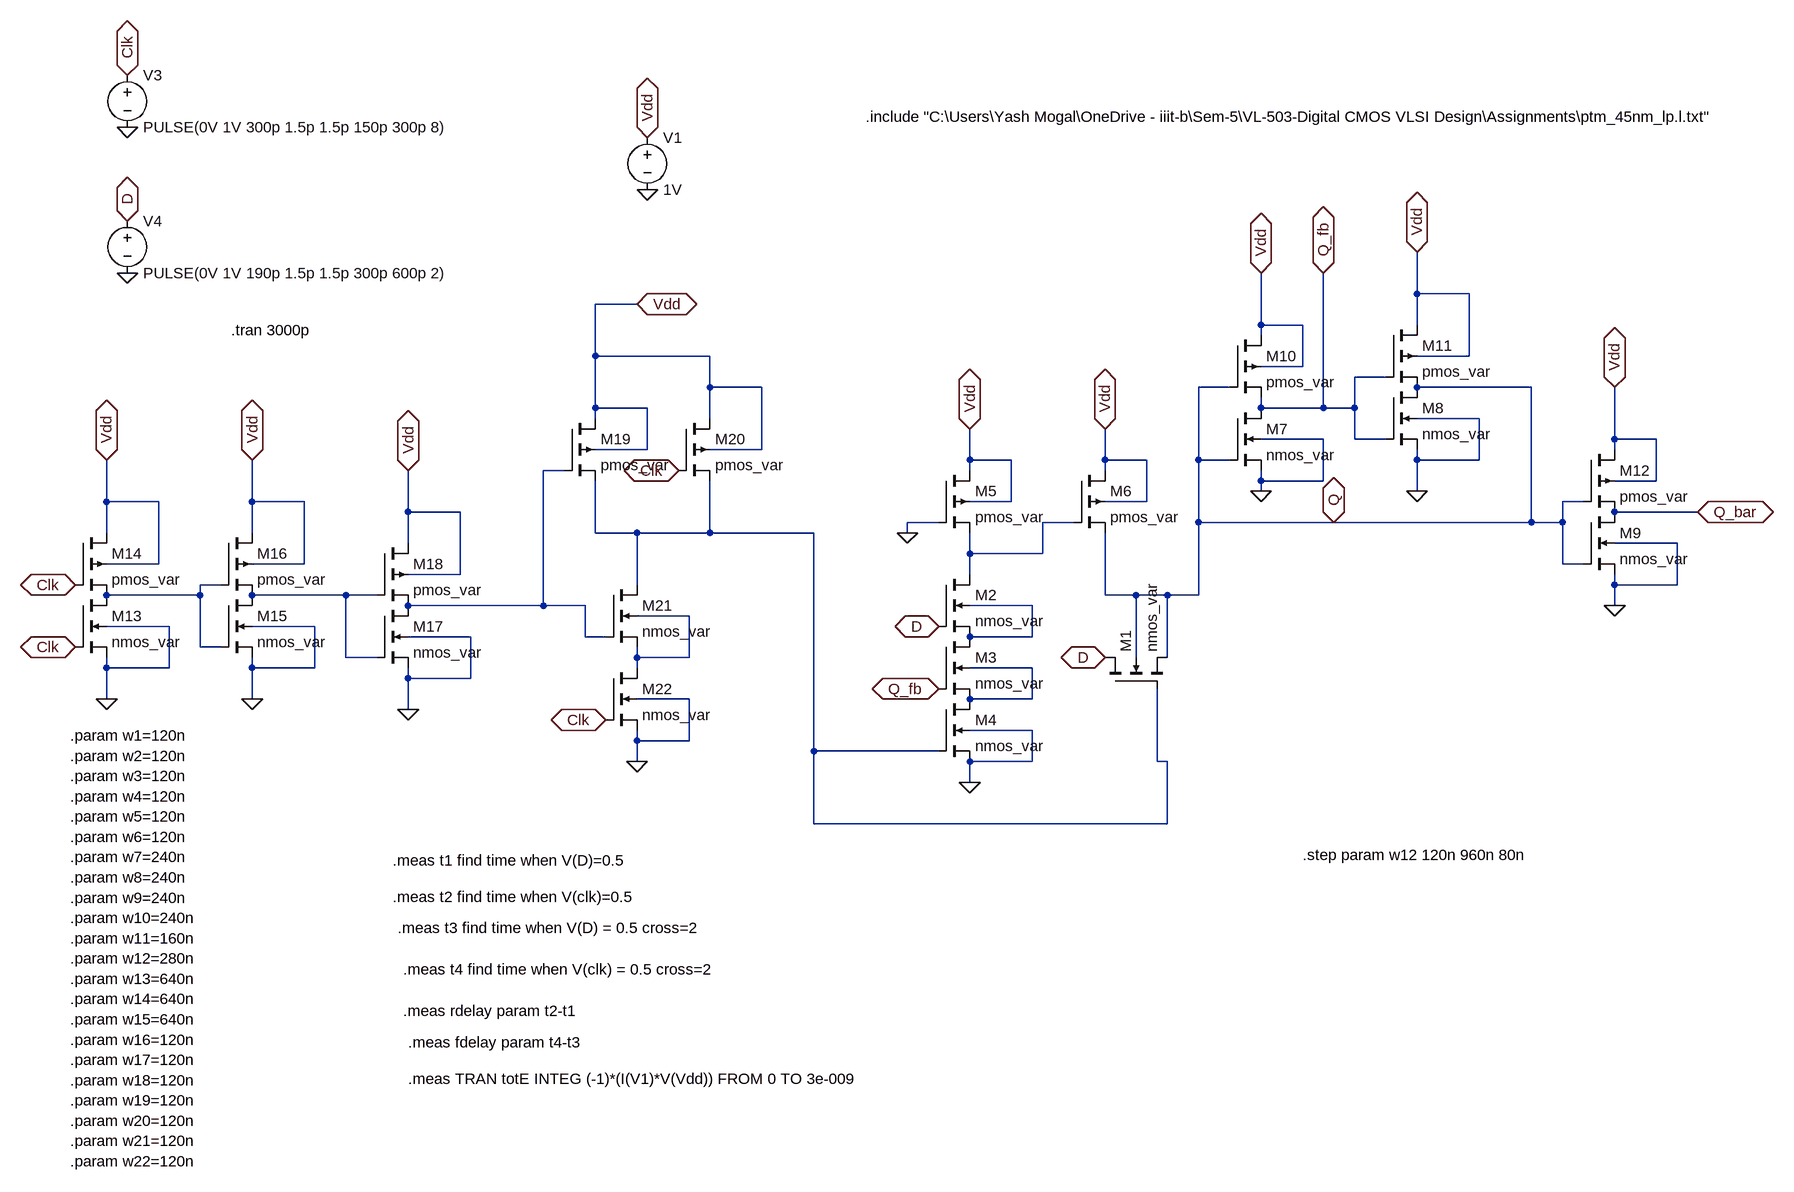
[diagram p0: schematic Project_SFTPFF.asc]
Project_SFTPFF.asc, the LTspice schematic file:
Version 4
SHEET 1 1344 836
WIRE 736 -448 736 -512
WIRE 816 -448 736 -448
WIRE -464 -432 -528 -432
WIRE 496 -400 496 -480
WIRE 560 -400 496 -400
WIRE 736 -400 736 -448
WIRE 496 -384 496 -400
WIRE -528 -352 -528 -432
WIRE -352 -352 -528 -352
WIRE 816 -352 816 -448
WIRE 816 -352 736 -352
WIRE 560 -336 560 -400
WIRE 560 -336 496 -336
WIRE 688 -320 640 -320
WIRE -352 -304 -352 -352
WIRE -272 -304 -352 -304
WIRE 448 -304 400 -304
WIRE 912 -304 736 -304
WIRE -528 -272 -528 -352
WIRE -448 -272 -528 -272
WIRE 496 -272 496 -288
WIRE 592 -272 592 -480
WIRE 592 -272 496 -272
WIRE 640 -272 640 -320
WIRE 640 -272 592 -272
WIRE -528 -256 -528 -272
WIRE -352 -256 -352 -304
WIRE 832 -256 736 -256
WIRE 592 -224 496 -224
WIRE 640 -224 640 -272
WIRE 688 -224 640 -224
WIRE 1040 -224 1040 -304
WIRE 1104 -224 1040 -224
WIRE -448 -208 -448 -272
WIRE -448 -208 -528 -208
WIRE -272 -208 -272 -304
WIRE -272 -208 -352 -208
WIRE 1040 -208 1040 -224
WIRE 48 -192 48 -240
WIRE 112 -192 48 -192
WIRE 256 -192 256 -240
WIRE 320 -192 256 -192
WIRE 400 -192 400 -304
WIRE 448 -192 400 -192
WIRE 736 -192 736 -208
WIRE 832 -192 832 -256
WIRE 832 -192 736 -192
WIRE -576 -176 -608 -176
WIRE 48 -176 48 -192
WIRE 256 -176 256 -192
WIRE 496 -160 496 -176
WIRE 592 -160 592 -224
WIRE 592 -160 496 -160
WIRE 1104 -160 1104 -224
WIRE 1104 -160 1040 -160
WIRE 496 -144 496 -160
WIRE 736 -144 736 -192
WIRE -1280 -128 -1280 -192
WIRE -1200 -128 -1280 -128
WIRE -1056 -128 -1056 -192
WIRE -976 -128 -1056 -128
WIRE 112 -128 112 -192
WIRE 112 -128 48 -128
WIRE 320 -128 320 -192
WIRE 320 -128 256 -128
WIRE 992 -128 960 -128
WIRE -816 -112 -816 -176
WIRE -736 -112 -816 -112
WIRE 1168 -112 1040 -112
WIRE 0 -96 -48 -96
WIRE 208 -96 160 -96
WIRE 400 -96 400 -192
WIRE 608 -96 400 -96
WIRE 912 -96 912 -304
WIRE 912 -96 608 -96
WIRE 960 -96 960 -128
WIRE 960 -96 912 -96
WIRE -1280 -80 -1280 -128
WIRE -1056 -80 -1056 -128
WIRE -528 -80 -528 -160
WIRE -464 -80 -528 -80
WIRE -352 -80 -352 -160
WIRE -352 -80 -464 -80
WIRE -192 -80 -352 -80
WIRE -48 -80 -48 -96
WIRE -816 -64 -816 -112
WIRE 1136 -64 1040 -64
WIRE 48 -48 48 -80
WIRE 160 -48 160 -96
WIRE 160 -48 48 -48
WIRE -1200 -32 -1200 -128
WIRE -1200 -32 -1280 -32
WIRE -976 -32 -976 -128
WIRE -976 -32 -1056 -32
WIRE 960 -32 960 -96
WIRE 992 -32 960 -32
WIRE -736 -16 -736 -112
WIRE -736 -16 -816 -16
WIRE 48 -16 48 -48
WIRE -1104 0 -1136 0
WIRE -464 0 -464 -80
WIRE 1040 0 1040 -16
WIRE 1136 0 1136 -64
WIRE 1136 0 1040 0
WIRE -1136 16 -1136 0
WIRE -1136 16 -1280 16
WIRE -912 16 -1056 16
WIRE -864 16 -912 16
WIRE 256 16 256 -80
WIRE 304 16 256 16
WIRE 352 16 304 16
WIRE 400 16 400 -96
WIRE 400 16 352 16
WIRE -608 32 -608 -176
WIRE -608 32 -816 32
WIRE -544 32 -608 32
WIRE 144 32 48 32
WIRE 1040 32 1040 0
WIRE -384 48 -464 48
WIRE -1184 64 -1280 64
WIRE -960 64 -1056 64
WIRE -720 80 -816 80
WIRE -544 80 -544 32
WIRE -512 80 -544 80
WIRE 144 80 144 32
WIRE 144 80 48 80
WIRE -1136 96 -1136 16
WIRE -1104 96 -1136 96
WIRE -912 112 -912 16
WIRE -864 112 -912 112
WIRE -464 112 -464 96
WIRE -384 112 -384 48
WIRE -384 112 -464 112
WIRE 304 112 304 16
WIRE 352 112 352 16
WIRE -1280 128 -1280 112
WIRE -1184 128 -1184 64
WIRE -1184 128 -1280 128
WIRE -1056 128 -1056 112
WIRE -960 128 -960 64
WIRE -960 128 -1056 128
WIRE -464 128 -464 112
WIRE 144 128 48 128
WIRE -816 144 -816 128
WIRE -720 144 -720 80
WIRE -720 144 -816 144
WIRE -1280 176 -1280 128
WIRE -1056 176 -1056 128
WIRE -384 176 -464 176
WIRE 144 176 144 128
WIRE 144 176 48 176
WIRE -816 192 -816 144
WIRE 144 224 48 224
WIRE -464 240 -464 224
WIRE -384 240 -384 176
WIRE -384 240 -464 240
WIRE -192 256 -192 -80
WIRE 0 256 -192 256
WIRE -464 272 -464 240
WIRE 144 272 144 224
WIRE 144 272 48 272
WIRE 336 272 336 160
WIRE 352 272 336 272
WIRE 48 304 48 272
WIRE -192 368 -192 256
WIRE 352 368 352 272
WIRE 352 368 -192 368
FLAG 48 304 0
FLAG -1248 -784 Clk
IOPIN -1248 -784 BiDir
FLAG 256 112 D
IOPIN 256 112 BiDir
FLAG 0 64 D
IOPIN 0 64 BiDir
FLAG -448 -688 Vdd
IOPIN -448 -688 BiDir
FLAG 48 -240 Vdd
IOPIN 48 -240 BiDir
FLAG 256 -240 Vdd
IOPIN 256 -240 BiDir
FLAG -448 -608 0
FLAG -48 -80 0
FLAG 496 -144 0
FLAG 496 -480 Vdd
IOPIN 496 -480 BiDir
FLAG 736 -512 Vdd
IOPIN 736 -512 BiDir
FLAG 1040 -304 Vdd
IOPIN 1040 -304 BiDir
FLAG 736 -144 0
FLAG 1040 32 0
FLAG 592 -480 Q_fb
IOPIN 592 -480 BiDir
FLAG 0 160 Q_fb
IOPIN 0 160 BiDir
FLAG 1168 -112 Q_bar
IOPIN 1168 -112 BiDir
FLAG 608 -96 Q
IOPIN 608 -96 BiDir
FLAG -1280 -192 Vdd
IOPIN -1280 -192 BiDir
FLAG -1280 176 0
FLAG -1056 -192 Vdd
IOPIN -1056 -192 BiDir
FLAG -1056 176 0
FLAG -816 -176 Vdd
IOPIN -816 -176 BiDir
FLAG -816 192 0
FLAG -400 -176 Clk
IOPIN -400 -176 BiDir
FLAG -512 208 Clk
IOPIN -512 208 BiDir
FLAG -464 -432 Vdd
IOPIN -464 -432 BiDir
FLAG -464 272 0
FLAG -1328 0 Clk
IOPIN -1328 0 BiDir
FLAG -1328 96 Clk
IOPIN -1328 96 BiDir
FLAG -1248 -704 0
FLAG -1248 -560 D
IOPIN -1248 -560 BiDir
FLAG -1248 -480 0
SYMBOL nmos4 0 -16 R0
SYMATTR InstName M2
SYMATTR Value nmos_var
SYMATTR Value2 l=45nm w=w13
SYMBOL nmos4 0 80 R0
SYMATTR InstName M3
SYMATTR Value nmos_var
SYMATTR Value2 l=45nm w=w14
SYMBOL nmos4 0 176 R0
SYMATTR InstName M4
SYMATTR Value nmos_var
SYMATTR Value2 l=45nm w=w15
SYMBOL nmos4 256 160 R270
SYMATTR InstName M1
SYMATTR Value nmos_var
SYMATTR Value2 l=45nm w=w16
SYMBOL pmos4 0 -176 R0
SYMATTR InstName M5
SYMATTR Value pmos_var
SYMATTR Value2 l=45nm w=w11
SYMBOL pmos4 208 -176 R0
SYMATTR InstName M6
SYMATTR Value pmos_var
SYMATTR Value2 l=45nm w=w12
SYMBOL voltage -448 -704 R0
WINDOW 123 0 0 Left 0
WINDOW 39 0 0 Left 0
SYMATTR InstName V1
SYMATTR Value 1V
SYMBOL nmos4 448 -272 R0
SYMATTR InstName M7
SYMATTR Value nmos_var
SYMATTR Value2 l=45nm w=w18
SYMBOL nmos4 688 -304 R0
SYMATTR InstName M8
SYMATTR Value nmos_var
SYMATTR Value2 l=45nm w=w20
SYMBOL nmos4 992 -112 R0
SYMATTR InstName M9
SYMATTR Value nmos_var
SYMATTR Value2 l=45nm w=w22
SYMBOL pmos4 448 -384 R0
SYMATTR InstName M10
SYMATTR Value pmos_var
SYMATTR Value2 l=45nm w=w17
SYMBOL pmos4 688 -400 R0
SYMATTR InstName M11
SYMATTR Value pmos_var
SYMATTR Value2 l=45nm w=w19
SYMBOL pmos4 992 -208 R0
SYMATTR InstName M12
SYMATTR Value pmos_var
SYMATTR Value2 l=45nm w=w21
SYMBOL nmos4 -1328 16 R0
SYMATTR InstName M13
SYMATTR Value nmos_var
SYMATTR Value2 l=45nm w=w2
SYMBOL pmos4 -1328 -80 R0
SYMATTR InstName M14
SYMATTR Value pmos_var
SYMATTR Value2 l=45nm w=w1
SYMBOL nmos4 -1104 16 R0
SYMATTR InstName M15
SYMATTR Value nmos_var
SYMATTR Value2 l=45nm w=w4
SYMBOL pmos4 -1104 -80 R0
SYMATTR InstName M16
SYMATTR Value pmos_var
SYMATTR Value2 l=45nm w=w3
SYMBOL nmos4 -864 32 R0
SYMATTR InstName M17
SYMATTR Value nmos_var
SYMATTR Value2 l=45nm w=w6
SYMBOL pmos4 -864 -64 R0
SYMATTR InstName M18
SYMATTR Value pmos_var
SYMATTR Value2 l=45nm w=w5
SYMBOL pmos4 -576 -256 R0
SYMATTR InstName M19
SYMATTR Value pmos_var
SYMATTR Value2 l=45nm w=w7
SYMBOL pmos4 -400 -256 R0
SYMATTR InstName M20
SYMATTR Value pmos_var
SYMATTR Value2 l=45nm w=w8
SYMBOL nmos4 -512 0 R0
SYMATTR InstName M21
SYMATTR Value nmos_var
SYMATTR Value2 l=45nm w=w9
SYMBOL nmos4 -512 128 R0
SYMATTR InstName M22
SYMATTR Value nmos_var
SYMATTR Value2 l=45nm w=w10
SYMBOL voltage -1248 -800 R0
WINDOW 123 0 0 Left 0
WINDOW 39 0 0 Left 0
SYMATTR InstName V3
SYMATTR Value PULSE(0V 1V 300p 1.5p 1.5p 150p 300p 8)
SYMBOL voltage -1248 -576 R0
WINDOW 123 0 0 Left 0
WINDOW 39 0 0 Left 0
SYMATTR InstName V4
SYMATTR Value PULSE(0V 1V 190p 1.5p 1.5p 300p 600p 2)
TEXT -1088 -392 Left 2 !.tran 3000p
TEXT -112 -720 Left 2 !.include "C:\\Users\\Yash Mogal\\OneDrive - iiit-b\\Sem-5\\VL-503-Digital CMOS VLSI Design\\Assignments\\ptm_45nm_lp.l.txt"
TEXT -1336 232 Left 2 !.param w1=120n\n.param w2=120n\n.param w3=120n\n.param w4=120n\n.param w5=120n\n.param w6=120n\n.param w7=240n\n.param w8=240n\n.param w9=240n\n.param w10=240n\n.param w11=160n\n.param w12=280n\n.param w13=640n\n.param w14=640n\n.param w15=640n\n.param w16=120n\n.param w17=120n\n.param w18=120n\n.param w19=120n\n.param w20=120n\n.param w21=120n\n.param w22=120n
TEXT -840 424 Left 2 !.meas t1 find time when V(D)=0.5
TEXT -840 480 Left 2 !.meas t2 find time when V(clk)=0.5
TEXT -832 528 Left 2 !.meas t3 find time when V(D) = 0.5 cross=2
TEXT -824 592 Left 2 !.meas t4 find time when V(clk) = 0.5 cross=2
TEXT -824 656 Left 2 !.meas rdelay param t2-t1
TEXT -816 704 Left 2 !.meas fdelay param t4-t3
TEXT -816 760 Left 2 !.meas TRAN totE INTEG (-1)*(I(V1)*V(Vdd)) FROM 0 TO 3e-009
TEXT 560 416 Left 2 !.step param w12 120n 960n 80n

The netlist it stands for:
* Project_SFTPFF.asc
M2 N002 D N006 N006 nmos_var l=45nm w=w13
M3 N006 Q_fb N008 N008 nmos_var l=45nm w=w14
M4 N008 N003 0 0 nmos_var l=45nm w=w15
M1 D N003 Q Q nmos_var l=45nm w=w16
M5 Vdd 0 N002 Vdd pmos_var l=45nm w=w11
M6 Vdd N002 Q Vdd pmos_var l=45nm w=w12
V1 Vdd 0 1V
M7 Q_fb Q 0 0 nmos_var l=45nm w=w18
M8 Q Q_fb 0 0 nmos_var l=45nm w=w20
M9 Q_bar Q 0 0 nmos_var l=45nm w=w22
M10 Vdd Q Q_fb Vdd pmos_var l=45nm w=w17
M11 Vdd Q_fb Q Vdd pmos_var l=45nm w=w19
M12 Vdd Q Q_bar Vdd pmos_var l=45nm w=w21
M13 N004 Clk 0 0 nmos_var l=45nm w=w2
M14 Vdd Clk N004 Vdd pmos_var l=45nm w=w1
M15 N005 N004 0 0 nmos_var l=45nm w=w4
M16 Vdd N004 N005 Vdd pmos_var l=45nm w=w3
M17 N001 N005 0 0 nmos_var l=45nm w=w6
M18 Vdd N005 N001 Vdd pmos_var l=45nm w=w5
M19 Vdd N001 N003 Vdd pmos_var l=45nm w=w7
M20 Vdd Clk N003 Vdd pmos_var l=45nm w=w8
M21 N003 N001 N007 N007 nmos_var l=45nm w=w9
M22 N007 Clk 0 0 nmos_var l=45nm w=w10
V3 Clk 0 PULSE(0V 1V 300p 1.5p 1.5p 150p 300p 8)
V4 D 0 PULSE(0V 1V 190p 1.5p 1.5p 300p 600p 2)
.model NMOS NMOS
.model PMOS PMOS
.lib standard.mos
.tran 3000p
.include "C:\Users\Yash Mogal\OneDrive - iiit-b\Sem-5\VL-503-Digital CMOS VLSI Design\Assignments\ptm_45nm_lp.l.txt"
.param w1=120n
.param w2=120n
.param w3=120n
.param w4=120n
.param w5=120n
.param w6=120n
.param w7=240n
.param w8=240n
.param w9=240n
.param w10=240n
.param w11=160n
.param w12=280n
.param w13=640n
.param w14=640n
.param w15=640n
.param w16=120n
.param w17=120n
.param w18=120n
.param w19=120n
.param w20=120n
.param w21=120n
.param w22=120n
.meas t1 find time when V(D)=0.5
.meas t2 find time when V(clk)=0.5
.meas t3 find time when V(D) = 0.5 cross=2
.meas t4 find time when V(clk) = 0.5 cross=2
.meas rdelay param t2-t1
.meas fdelay param t4-t3
.meas TRAN totE INTEG (-1)*(I(V1)*V(Vdd)) FROM 0 TO 3e-009
.step param w12 120n 960n 80n
.backanno
.end